# Altium schematic sheet CHARGER_2A.SchDoc: =DocumentName
size A4; CompanyName: "AS Manufacturing" LLC; Organization: "AS Manufacturing" LLC; Address1: 5 Sklyarenka St.; Address2: Kyiv 04073; Address3: Ukraine; Address4: https://ajax.systems/en/; DocumentNumber: 5; SheetNumber: 5; SheetTotal: 7; Template_version: 1.0.1
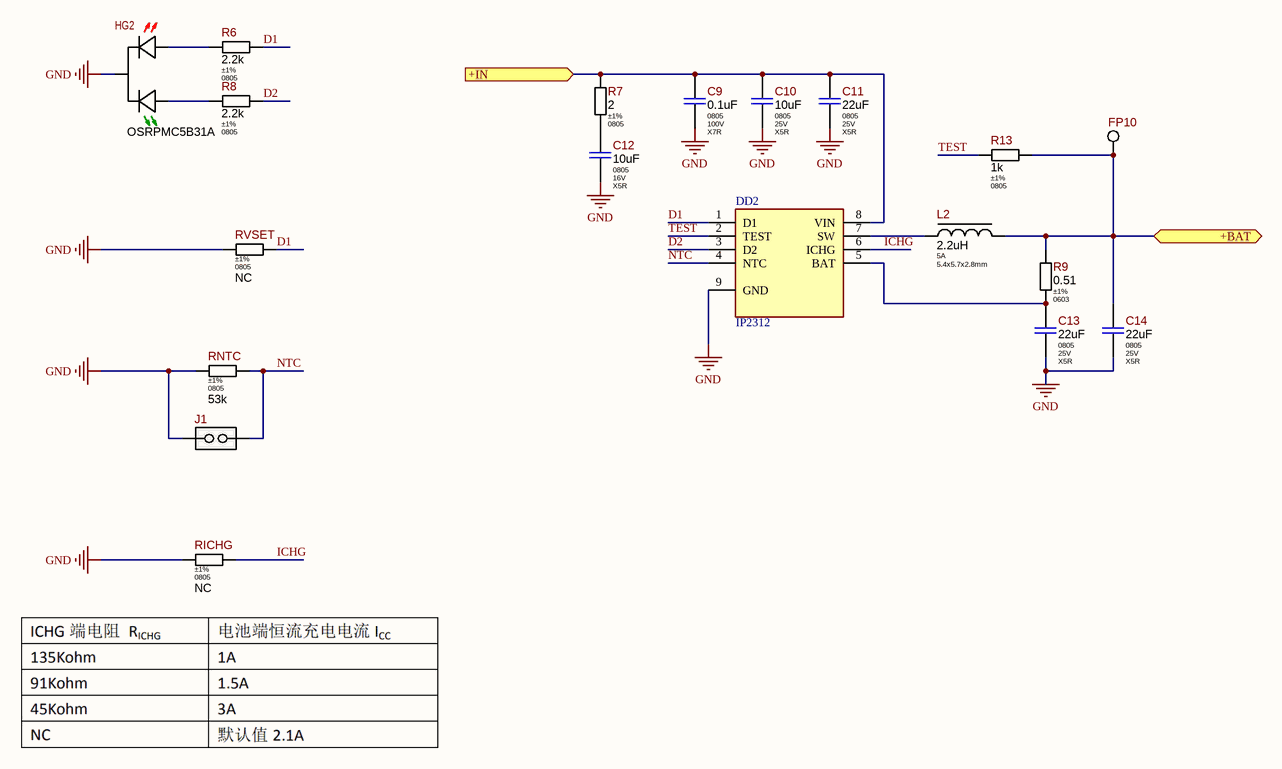
[diagram p0: CHARGER_2A.SchDoc]

## Parts
C9  Package: 0805  Voltage: 100V  Dielectric Type: X7R  [C_CERAMIC_0805_MED]  (hidden comment: 0.1uF)
C10  Package: 0805  Voltage: 25V  Dielectric Type: X5R  [CAP-0805(2012)X85T10]  (hidden comment: 10uF)
C11  Package: 0805  Voltage: 25V  Dielectric Type: X5R  [CAP-0805(2012)X125T15]  (hidden comment: 22uF)
C12  Package: 0805  Voltage: 16V  Dielectric Type: X5R  [CAP-0805(2012)X125T15]  (hidden comment: 10uF)
C13  Package: 0805  Voltage: 25V  Dielectric Type: X5R  [CAP-0805(2012)X125T15]  (hidden comment: 22uF)
C14  Package: 0805  Voltage: 25V  Dielectric Type: X5R  [CAP-0805(2012)X125T15]  (hidden comment: 22uF)
DD2  IP2312  [IP2313]
FP10  PAD-1.45mm  [PAD-1.45mm]  (value not drawn)  (no BOM)
HG2  OSRPMC5B31A  [OSRPMC5B31A]
J1  PLS-2 (Part of PLS-40)  [PLS-2]  (value not drawn)
L2  Current: 5A  Package: 5.4x5.7x2.8mm  [BMRA00050530-Series]  (hidden comment: 2.2uH)
R6  Tolerance: ±1%  Package: 0805  [R_ANY_CHIP_0805_MED]  (hidden comment: 2.2k)
R7  Tolerance: ±1%  Package: 0805  [R_ANY_CHIP_0805_MED]  (hidden comment: 2)
R8  Tolerance: ±1%  Package: 0805  [R_ANY_CHIP_0805_MED]  (hidden comment: 2.2k)
R9  Tolerance: ±1%  Package: 0603  [R_ANY_CHIP_0603_MED]  (hidden comment: 0.51)
R13  Tolerance: ±1%  Package: 0805  [R_ANY_CHIP_0805_MED]  (hidden comment: 1k)
RICHG  Tolerance: ±1%  Package: 0805  [R_ANY_CHIP_0805_MED]  (hidden comment: NC)
RNTC  Tolerance: ±1%  Package: 0805  [R_ANY_CHIP_0805_MED]  (hidden comment: 53k)
RVSET  Tolerance: ±1%  Package: 0805  [R_ANY_CHIP_0805_MED]  (hidden comment: NC)

## Ports
+BAT (bidir), +IN (in)

## Nets
GND: C9.2 C10.2 C11.2 C12.2 C13.2 C14.2 DD2.9(GND) HG2.CC(Cathode) J1.1 RICHG.1 RNTC.1 RVSET.1
+BAT: C14.1 FP10.1 L2.2 R9.1 R13.2 ; port +BAT
+IN: C9.1 C10.1 C11.1 DD2.8(VIN) R7.1 ; port +IN
D1: DD2.1(D1) R6.2 RVSET.2
D2: DD2.3(D2) R8.2
ICHG: DD2.6(ICHG) RICHG.2
NTC: DD2.4(NTC) J1.2 RNTC.2
TEST: DD2.2(TEST) R13.1
NetC12_1: C12.1 R7.2
NetC13_1: C13.1 DD2.5(BAT) R9.2
NetDD2_7: DD2.7(SW) L2.1
NetHG2_A1: HG2.A1 R6.1
NetHG2_A2: HG2.A2 R8.1

## Notes on the sheet
- Title
- Product:
- Project:
- Size:
- Date:
- Variant:
- A4
- Authors:
- Time:
- Sheet
- of
- Revision:
- @Vitech_ua
- Commit:

## Library data of the parts
C9 = CL21B104KCFSFNE: 100nF 100V X7R ±10% 0805 Ceramic Capacitor RoHS; Manufacturer: Samsung Electro-Mechanics; Ajax_1C_ID: 12279; Ajax_1C_PN: 100nF 100V X7R 10% 0805 CL21B104KCFSFNE Ceramic Capacitor SMD RoHS; Ajax_1С_Status: Mass Production; Standard Lead Time: 22 Weeks; Component Status: Released; Replacement: NONE; GUID_1C: e54cb00c-325f-11e8-822c-14dda9d2d04d; Value: 0.1uF; Part Number: CL21B104KCFSFNE; Part Type: Ceramic / X7R / 0805; Component Type: SMD; Temperature Range: -55°C ~ 125°C; Tolerance: ±10%; ComponentLink1URL: https://media.digikey.com/pdf/Data%20Sheets/Samsung%20PDFs/CL_Series_MLCC_ds.pdf; Supplier 1: Digi-Key; Supplier Part Number 1: 1276-2923-2-ND; Price: 0,0054; ComponentLink1Description: Datasheet
C10 = C2012X5R1E106M085AC: 10uF 25V X5R ±20% 0805 Ceramic Capacitor RoHS; Manufacturer: TDK Corporation; Ajax_1C_ID: 13798; Ajax_1C_PN: 10uF 25V X5R 20% 0805 C2012X5R1E106M085AC Ceramic Capacitor SMD RoHS; Ajax_1С_Status: Mass Production; Standard Lead Time: 12 Weeks; Component Status: Released; Replacement: NONE; GUID_1C: d6f4b954-ba78-11e8-ab45-005056918265; Value: 10uF; Part Number: C2012X5R1E106M085AC; Part Type: Ceramic / X5R / 0805; Component Type: SMD; Temperature Range: -55°C ~ 85°C; Tolerance: ±20%; ComponentLink1URL: https://product.tdk.com/info/en/catalog/datasheets/mlcc_commercial_general_en.pdf; Supplier 1: Digi-Key; Supplier Part Number 1: 445-14388-1-ND; Price: 0,2673; ComponentLink1Description: Datasheet
C11 C13 C14 = CL21A226MAQNNNE: 22uF 25V X5R ±20% 0805 Ceramic Capacitor RoHS; Manufacturer: Samsung Electro-Mechanics; Ajax_1C_ID: 23499; Ajax_1C_PN: 22uF 25V X5R 20% 0805 CL21A226MAQNNNE Samsung Ceramic Capacitor SMD RoHS; Ajax_1С_Status: Mass Production; Standard Lead Time: 20 Weeks; Component Status: Released; Replacement: NONE; GUID_1C: 5446b6ba-1abc-11eb-ab6d-0050569f2651; Value: 22uF; Part Number: CL21A226MAQNNNE; Part Type: Ceramic / X5R / 0805; Component Type: SMD; Temperature Range: -55°C ~ 85°C; Tolerance: ±20%; ComponentLink1URL: https://eu.mouser.com/datasheet/2/585/MLCC-1837944.pdf; Supplier 1: Mouser; Supplier Part Number 1: 187-CL21A226MAQNNNE; Price: 0,038; ComponentLink1Description: Datasheet
C12 = CL21A106KOQNNNE: 10uF 16V Х5R ±10% 0805 Ceramic Capacitor RoHS; Manufacturer: Samsung Electro-Mechanics; Ajax_1C_ID: 2350; Ajax_1C_PN: 10uF 16V Х5R 10% 0805 CL21A106KOQNNNE Ceramic Capacitor SMD RoHS; Ajax_1С_Status: Mass Production; Standard Lead Time: 22 Weeks; Component Status: Released; Replacement: NONE; GUID_1C: 272845d6-647b-11e2-9b5b-6c626deda1bb; Value: 10uF; Part Number: CL21A106KOQNNNE; Part Type: Ceramic / X5R / 0805; Component Type: SMD; Temperature Range: -55°C ~ 85°C; Tolerance: ±10%; ComponentLink1URL: https://media.digikey.com/pdf/Data%20Sheets/Samsung%20PDFs/CL_Series_MLCC_ds.pdf; Supplier 1: Digi-Key; Supplier Part Number 1: 1276-1096-2-ND; Price: 0,0072; ComponentLink1Description: Datasheet
FP10 = PAD-1.45mm: 1.45mm Pad for Plug-In or Receptacle; Ajax_1C_PN: NONE; Ajax_1С_Status: RND Only; Component Status: Released; Part Number: PAD-1.45mm; Component Type: PTH; Manufacturer: NONE; Part Type: Pad; Temperature Range: NONE; ComponentLink1URL: NONE; Replacement: NONE; Price: NONE; ComponentLink1Description: Datasheet
HG2 = OSRPMC5B31A: 5mm Phoenix Red & Pure Green LED, 625nm and 525nm, 30°; Manufacturer: OptoSupply; Ajax_1C_ID: 42089; Ajax_1C_PN: OSRPMC5B31A F5  RED/GREEN 3.3V  Common Cathode; Ajax_1С_Status: RND Only; Component Status: On Review; Wavelength: 625nm, 525nm; Replacement: NONE; GUID_1C: 10faf48a-c158-11ec-a35b-005056994834; Part Number: OSRPMC5B31A; Part Type: LED / 5mm; Component Type: PTH; Package: 5mm; Color: Red, Green; Temperature Range: -30°C ~ 85°C; ComponentLink1URL: \\altiumdb.ajax.local\files\Datasheet\Opto\OSRPMC5B31A.pdf; Price: 0,125; ComponentLink1Description: Datasheet
J1 = DS1021-02SF11: 2 Pin 2.54mm Male Header, Vertical, 3mm and 6.1mm, PLS-2; Manufacturer: Connfly; Ajax_1C_ID: 1215; Ajax_1C_PN: PLS40, планки со штырьками; Ajax_1С_Status: Mass Production; Component Status: Released; Replacement: NONE; GUID_1C: 10be163c-dd40-11e0-af93-6c626deda1bb; Part Number: DS1021-02SF11; Part Type: Header / Male Pin / Single Row; Component Type: PTH; Temperature Range: -40°C ~ 105°C; ComponentLink1URL: \\altiumdb.ajax.local\files\Datasheet\Connectors\DS1021.pdf; Price: 0,001875; ComponentLink1Description: Datasheet
L2 = BMRA000505302R2MA1: 2.2uH 5A 35mOhm max Closed Magnetic, Molding Processing, Ultra High Current Power Inductor; Manufacturer: Chilisin; Ajax_1C_ID: 84493; Ajax_1C_PN: 2.2uH 20% 5A 5.7x5.4mm BMRA000505302R2MA1 Chilisin Electronics; Ajax_1С_Status: RND Only; Saturation Current: 8A; Tolerance: ±20%; Component Status: Released; Replacement: NONE; GUID_1C: 5ef22b21-6e83-11ee-a91e-00505699469b; Value: 2.2uH; Part Number: BMRA000505302R2MA1; Part Type: Power / Wirewound; Component Type: SMD; Temperature Range: -55°C ~ 125°C; ComponentLink1URL: https://eu.mouser.com/datasheet/2/447/BMRx_Series-2943964.pdf; Supplier 1: Digi-Key; Supplier Part Number 1: 553-BMRA000505302R2MA1TR-ND; Price: 0,7; ComponentLink1Description: Datasheet
R6 R8 = RC0805FR-072K2L: 2.2 kOhms ±1% 1/8W 0805 Thick Film Resistor; Manufacturer: Yageo; Ajax_1C_ID: 30906; Ajax_1C_PN: 2.2k 1% 0805 Resistors SMD RoHS; Ajax_1С_Status: RND Only; Power Rating: 0.125W; Voltage: 150V; Component Status: Released; Temperature Stability: ±100ppm/°C; Replacement: NONE; GUID_1C: 690422a9-c9eb-11eb-ab74-0050569f2651; Value: 2.2k; Part Number: RC0805FR-072K2L; Component Type: SMD; Part Type: Thick Film; Temperature Range: -55°C ~ 155°C; ComponentLink1URL: https://eu.mouser.com/datasheet/2/447/YAGEO_PYu_RC_Group_51_RoHS_L_12-3313492.pdf; Supplier 1: Mouser; Supplier Part Number 1: 603-RC0805FR-072K2L; Price: 0.0014; ComponentLink1Description: Datasheet
R7 = RC0805FR-072RL: 2 Ohm ±1%, 1/8W 0805 Thick Film Resistor; Manufacturer: Yageo; Ajax_1C_ID: 9244; Ajax_1C_PN: 2R 1% 0805  Resistors SMD RoHS; Ajax_1С_Status: RND Only; Power Rating: 0.125W; Voltage: 150V; Component Status: Released; Temperature Stability: ±200ppm/°C; Replacement: NONE; GUID_1C: 2cef56fd-bde9-11e6-826e-d8cb8a9acc66; Value: 2; Part Number: RC0805FR-072RL; Component Type: SMD; Part Type: Thick Film; Temperature Range: -55°C ~ 155°C; ComponentLink1URL: https://eu.mouser.com/datasheet/2/447/PYu_RC_Group_51_RoHS_L_10-1664068.pdf; Supplier 1: Mouser; Supplier Part Number 1: 603-RC0805FR-072RL; Price: 0,09; ComponentLink1Description: Datasheet
R9 = RL0603FR-070R51L: 510 mOhms ±1%, 1/10W 0603 Thick Film Resistor; Manufacturer: Yageo; Ajax_1C_ID: 15962; Ajax_1C_PN: 0.51R 1% 0603 Resistors SMD RoHS; Ajax_1С_Status: RND Only; Power Rating: 0.1W; Voltage: NONE; Component Status: Released; Temperature Stability: ±300ppm/°C; GUID_1C: c10a41ba-7620-11e9-ab53-0050569f2651; Value: 0.51; Part Number: RL0603FR-070R51L; Component Type: SMD; Part Type: Thick Film; Temperature Range: -55°C ~ 155°C; ComponentLink1URL: https://www.yageo.com/upload/media/product/productsearch/datasheet/rchip/PYu-RL_Group_521_RoHS_L_2.pdf; Supplier 1: Digi-Key; Supplier Part Number 1: 311-.51QTR-ND; Replacement: NONE; Price: 0,04488; ComponentLink1Description: Datasheet
R13 = RC0805FR-071KL: 1 kOhms ±1%, 1/8W 0805 Thick Film Resistor; Manufacturer: Yageo; Ajax_1C_ID: 8520; Ajax_1C_PN: 1k 1% 0805 Resistors SMD RoHS; Ajax_1С_Status: Mass Production; Power Rating: 0.125W; Voltage: 150V; Component Status: Released; Temperature Stability: ±100ppm/°C; Replacement: NONE; GUID_1C: 0c53a8ec-2890-11e6-81ae-d8cb8a9acc66; Value: 1k; Part Number: RC0805FR-071KL; Component Type: SMD; Part Type: Thick Film; Temperature Range: -55°C ~ 155°C; ComponentLink1URL: https://eu.mouser.com/datasheet/2/447/PYu_RC_Group_51_RoHS_L_10-1664068.pdf; Supplier 1: Digi-Key; Supplier Part Number 1: 311-1.00KCRTR-ND; Price: 0,0014; ComponentLink1Description: Datasheet
RICHG RNTC RVSET = RC0805FR-07120RL: Manufacturer: Yageo; Ajax_1C_ID: 14156; Ajax_1C_PN: 120R 1% 0805 Resistors SMD RoHS; Ajax_1С_Status: Mass Production; Power Rating: 0.125W; Voltage: 150V; Component Status: Released; Temperature Stability: ±100ppm/°C; Replacement: NONE; GUID_1C: b31bb40e-dc54-11e8-ab4a-0050569f2651; Part Number: RC0805FR-07120RL; Component Type: SMD; Part Type: Thick Film; Temperature Range: -55°C ~ 155°C; ComponentLink1URL: https://eu.mouser.com/datasheet/2/447/PYu_RC_Group_51_RoHS_L_10-1664068.pdf; Price: 0,0014; ComponentLink1Description: Datasheet
  RICHG RVSET: Value: NC
  RNTC: Value: 53k